# Altium schematic sheet VALVEBOARD_ValveDrive3.SchDoc
size A3; SheetNumber: 6; SheetTotal: 7
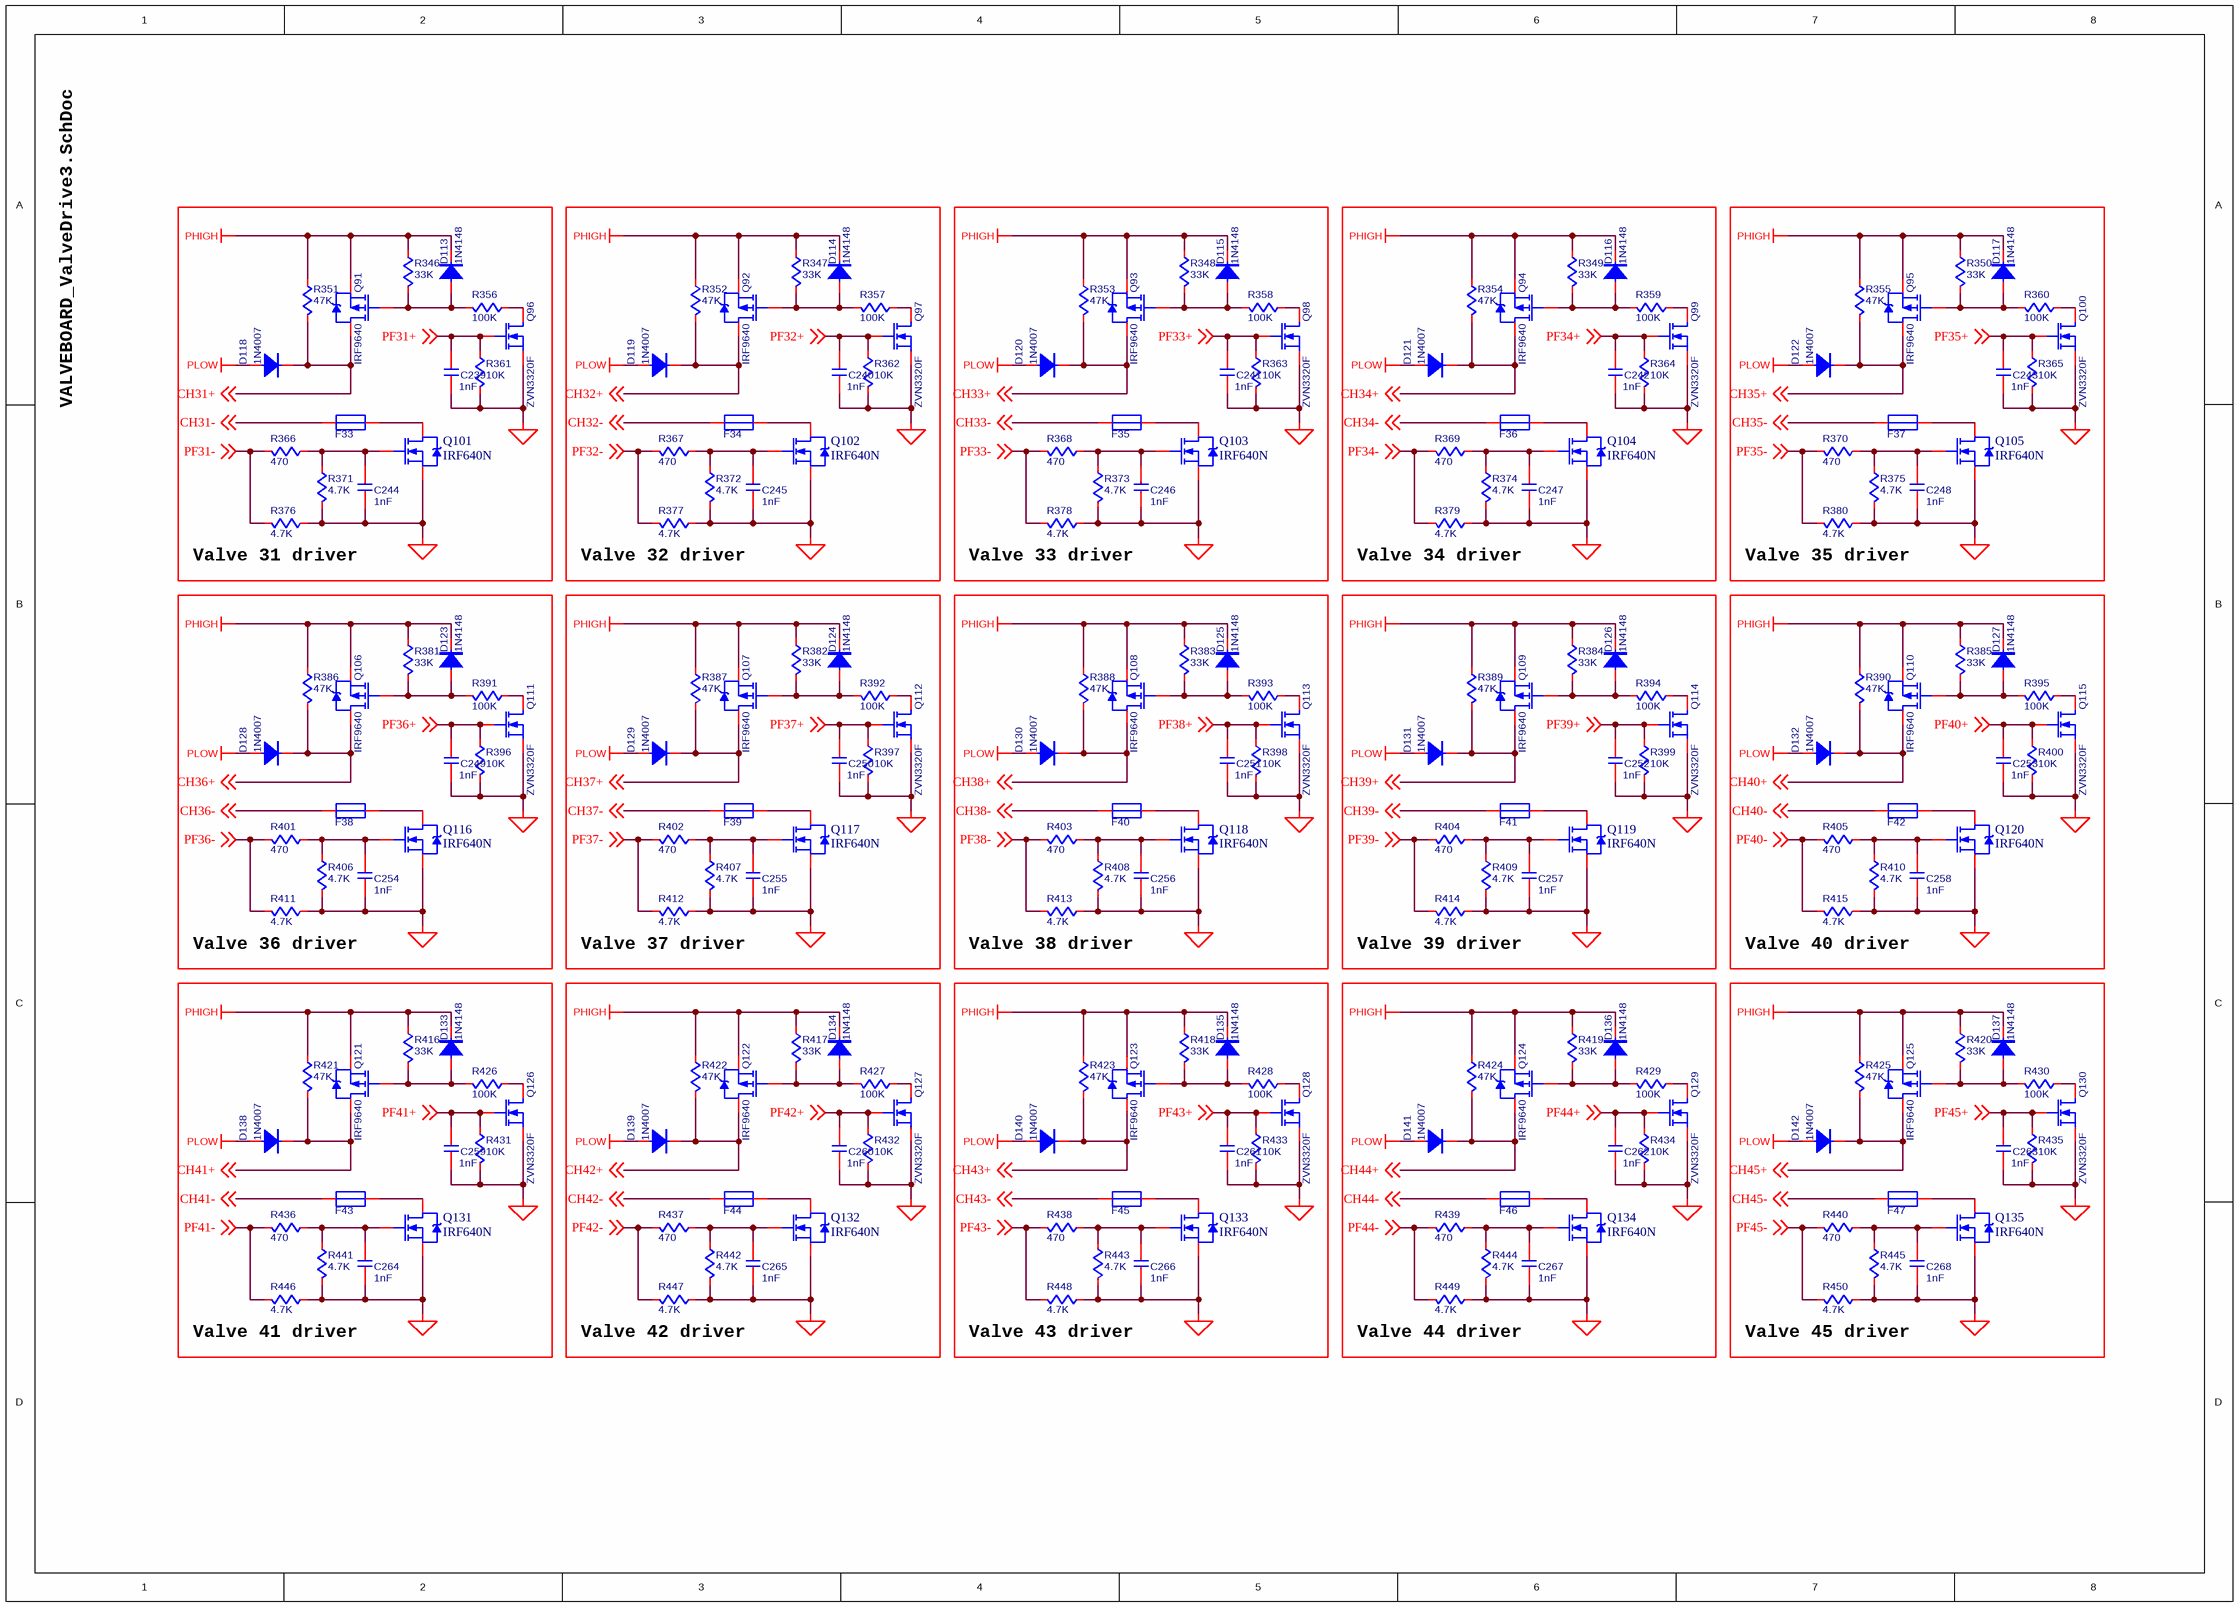
[diagram p0: VALVEBOARD_ValveDrive3.SchDoc]

## Parts
C239  value 1nF  [C0603]  (hidden comment: C-NOMO)
C240  value 1nF  [C0603]  (hidden comment: C-NOMO)
C241  value 1nF  [C0603]  (hidden comment: C-NOMO)
C242  value 1nF  [C0603]  (hidden comment: C-NOMO)
C243  value 1nF  [C0603]  (hidden comment: C-NOMO)
C244  value 1nF  [C0603]  (hidden comment: C-NOMO)
C245  value 1nF  [C0603]  (hidden comment: C-NOMO)
C246  value 1nF  [C0603]  (hidden comment: C-NOMO)
C247  value 1nF  [C0603]  (hidden comment: C-NOMO)
C248  value 1nF  [C0603]  (hidden comment: C-NOMO)
C249  value 1nF  [C0603]  (hidden comment: C-NOMO)
C250  value 1nF  [C0603]  (hidden comment: C-NOMO)
C251  value 1nF  [C0603]  (hidden comment: C-NOMO)
C252  value 1nF  [C0603]  (hidden comment: C-NOMO)
C253  value 1nF  [C0603]  (hidden comment: C-NOMO)
C254  value 1nF  [C0603]  (hidden comment: C-NOMO)
C255  value 1nF  [C0603]  (hidden comment: C-NOMO)
C256  value 1nF  [C0603]  (hidden comment: C-NOMO)
C257  value 1nF  [C0603]  (hidden comment: C-NOMO)
C258  value 1nF  [C0603]  (hidden comment: C-NOMO)
C259  value 1nF  [C0603]  (hidden comment: C-NOMO)
C260  value 1nF  [C0603]  (hidden comment: C-NOMO)
C261  value 1nF  [C0603]  (hidden comment: C-NOMO)
C262  value 1nF  [C0603]  (hidden comment: C-NOMO)
C263  value 1nF  [C0603]  (hidden comment: C-NOMO)
C264  value 1nF  [C0603]  (hidden comment: C-NOMO)
C265  value 1nF  [C0603]  (hidden comment: C-NOMO)
C266  value 1nF  [C0603]  (hidden comment: C-NOMO)
C267  value 1nF  [C0603]  (hidden comment: C-NOMO)
C268  value 1nF  [C0603]  (hidden comment: C-NOMO)
D113  1N4148  [SOD-123]
D114  1N4148  [SOD-123]
D115  1N4148  [SOD-123]
D116  1N4148  [SOD-123]
D117  1N4148  [SOD-123]
D118  1N4007  [1N4148]
D119  1N4007  [1N4148]
D120  1N4007  [1N4148]
D121  1N4007  [1N4148]
D122  1N4007  [1N4148]
D123  1N4148  [SOD-123]
D124  1N4148  [SOD-123]
D125  1N4148  [SOD-123]
D126  1N4148  [SOD-123]
D127  1N4148  [SOD-123]
D128  1N4007  [1N4148]
D129  1N4007  [1N4148]
D130  1N4007  [1N4148]
D131  1N4007  [1N4148]
D132  1N4007  [1N4148]
D133  1N4148  [SOD-123]
D134  1N4148  [SOD-123]
D135  1N4148  [SOD-123]
D136  1N4148  [SOD-123]
D137  1N4148  [SOD-123]
D138  1N4007  [1N4148]
D139  1N4007  [1N4148]
D140  1N4007  [1N4148]
D141  1N4007  [1N4148]
D142  1N4007  [1N4148]
F33  F50  [F-TH]  (value not drawn)
F34  F50  [F-TH]  (value not drawn)
F35  F50  [F-TH]  (value not drawn)
F36  F50  [F-TH]  (value not drawn)
F37  F50  [F-TH]  (value not drawn)
F38  F50  [F-TH]  (value not drawn)
F39  F50  [F-TH]  (value not drawn)
F40  F50  [F-TH]  (value not drawn)
F41  F50  [F-TH]  (value not drawn)
F42  F50  [F-TH]  (value not drawn)
F43  F50  [F-TH]  (value not drawn)
F44  F50  [F-TH]  (value not drawn)
F45  F50  [F-TH]  (value not drawn)
F46  F50  [F-TH]  (value not drawn)
F47  F50  [F-TH]  (value not drawn)
Q91  IRF9640  [TO-220AB]
Q92  IRF9640  [TO-220AB]
Q93  IRF9640  [TO-220AB]
Q94  IRF9640  [TO-220AB]
Q95  IRF9640  [TO-220AB]
Q96  ZVN3320F  [ZVN3320F]
Q97  ZVN3320F  [ZVN3320F]
Q98  ZVN3320F  [ZVN3320F]
Q99  ZVN3320F  [ZVN3320F]
Q100  ZVN3320F  [ZVN3320F]
Q101  IRF640N  [TO-220AB]
Q102  IRF640N  [TO-220AB]
Q103  IRF640N  [TO-220AB]
Q104  IRF640N  [TO-220AB]
Q105  IRF640N  [TO-220AB]
Q106  IRF9640  [TO-220AB]
Q107  IRF9640  [TO-220AB]
Q108  IRF9640  [TO-220AB]
Q109  IRF9640  [TO-220AB]
Q110  IRF9640  [TO-220AB]
Q111  ZVN3320F  [ZVN3320F]
Q112  ZVN3320F  [ZVN3320F]
Q113  ZVN3320F  [ZVN3320F]
Q114  ZVN3320F  [ZVN3320F]
Q115  ZVN3320F  [ZVN3320F]
Q116  IRF640N  [TO-220AB]
Q117  IRF640N  [TO-220AB]
Q118  IRF640N  [TO-220AB]
Q119  IRF640N  [TO-220AB]
Q120  IRF640N  [TO-220AB]
Q121  IRF9640  [TO-220AB]
Q122  IRF9640  [TO-220AB]
Q123  IRF9640  [TO-220AB]
Q124  IRF9640  [TO-220AB]
Q125  IRF9640  [TO-220AB]
Q126  ZVN3320F  [ZVN3320F]
Q127  ZVN3320F  [ZVN3320F]
Q128  ZVN3320F  [ZVN3320F]
Q129  ZVN3320F  [ZVN3320F]
Q130  ZVN3320F  [ZVN3320F]
Q131  IRF640N  [TO-220AB]
Q132  IRF640N  [TO-220AB]
Q133  IRF640N  [TO-220AB]
Q134  IRF640N  [TO-220AB]
Q135  IRF640N  [TO-220AB]
R346  value 33K  [R0603]  (hidden comment: R)
R347  value 33K  [R0603]  (hidden comment: R)
R348  value 33K  [R0603]  (hidden comment: R)
R349  value 33K  [R0603]  (hidden comment: R)
R350  value 33K  [R0603]  (hidden comment: R)
R351  value 47K  [R2512]  (hidden comment: R)
R352  value 47K  [R2512]  (hidden comment: R)
R353  value 47K  [R2512]  (hidden comment: R)
R354  value 47K  [R2512]  (hidden comment: R)
R355  value 47K  [R2512]  (hidden comment: R)
R356  value 100K  [R0603]  (hidden comment: R)
R357  value 100K  [R0603]  (hidden comment: R)
R358  value 100K  [R0603]  (hidden comment: R)
R359  value 100K  [R0603]  (hidden comment: R)
R360  value 100K  [R0603]  (hidden comment: R)
R361  value 10K  [R0603]  (hidden comment: R)
R362  value 10K  [R0603]  (hidden comment: R)
R363  value 10K  [R0603]  (hidden comment: R)
R364  value 10K  [R0603]  (hidden comment: R)
R365  value 10K  [R0603]  (hidden comment: R)
R366  value 470  [R0402]  (hidden comment: R)
R367  value 470  [R0402]  (hidden comment: R)
R368  value 470  [R0402]  (hidden comment: R)
R369  value 470  [R0402]  (hidden comment: R)
R370  value 470  [R0402]  (hidden comment: R)
R371  value 4.7K  [R0402]  (hidden comment: R)
R372  value 4.7K  [R0402]  (hidden comment: R)
R373  value 4.7K  [R0402]  (hidden comment: R)
R374  value 4.7K  [R0402]  (hidden comment: R)
R375  value 4.7K  [R0402]  (hidden comment: R)
R376  value 4.7K  [R0402]  (hidden comment: R)
R377  value 4.7K  [R0402]  (hidden comment: R)
R378  value 4.7K  [R0402]  (hidden comment: R)
R379  value 4.7K  [R0402]  (hidden comment: R)
R380  value 4.7K  [R0402]  (hidden comment: R)
R381  value 33K  [R0603]  (hidden comment: R)
R382  value 33K  [R0603]  (hidden comment: R)
R383  value 33K  [R0603]  (hidden comment: R)
R384  value 33K  [R0603]  (hidden comment: R)
R385  value 33K  [R0603]  (hidden comment: R)
R386  value 47K  [R2512]  (hidden comment: R)
R387  value 47K  [R2512]  (hidden comment: R)
R388  value 47K  [R2512]  (hidden comment: R)
R389  value 47K  [R2512]  (hidden comment: R)
R390  value 47K  [R2512]  (hidden comment: R)
R391  value 100K  [R0603]  (hidden comment: R)
R392  value 100K  [R0603]  (hidden comment: R)
R393  value 100K  [R0603]  (hidden comment: R)
R394  value 100K  [R0603]  (hidden comment: R)
R395  value 100K  [R0603]  (hidden comment: R)
R396  value 10K  [R0603]  (hidden comment: R)
R397  value 10K  [R0603]  (hidden comment: R)
R398  value 10K  [R0603]  (hidden comment: R)
R399  value 10K  [R0603]  (hidden comment: R)
R400  value 10K  [R0603]  (hidden comment: R)
R401  value 470  [R0402]  (hidden comment: R)
R402  value 470  [R0402]  (hidden comment: R)
R403  value 470  [R0402]  (hidden comment: R)
R404  value 470  [R0402]  (hidden comment: R)
R405  value 470  [R0402]  (hidden comment: R)
R406  value 4.7K  [R0402]  (hidden comment: R)
R407  value 4.7K  [R0402]  (hidden comment: R)
R408  value 4.7K  [R0402]  (hidden comment: R)
R409  value 4.7K  [R0402]  (hidden comment: R)
R410  value 4.7K  [R0402]  (hidden comment: R)
R411  value 4.7K  [R0402]  (hidden comment: R)
R412  value 4.7K  [R0402]  (hidden comment: R)
R413  value 4.7K  [R0402]  (hidden comment: R)
R414  value 4.7K  [R0402]  (hidden comment: R)
R415  value 4.7K  [R0402]  (hidden comment: R)
R416  value 33K  [R0603]  (hidden comment: R)
R417  value 33K  [R0603]  (hidden comment: R)
R418  value 33K  [R0603]  (hidden comment: R)
R419  value 33K  [R0603]  (hidden comment: R)
R420  value 33K  [R0603]  (hidden comment: R)
R421  value 47K  [R2512]  (hidden comment: R)
R422  value 47K  [R2512]  (hidden comment: R)
R423  value 47K  [R2512]  (hidden comment: R)
R424  value 47K  [R2512]  (hidden comment: R)
R425  value 47K  [R2512]  (hidden comment: R)
R426  value 100K  [R0603]  (hidden comment: R)
R427  value 100K  [R0603]  (hidden comment: R)
R428  value 100K  [R0603]  (hidden comment: R)
R429  value 100K  [R0603]  (hidden comment: R)
R430  value 100K  [R0603]  (hidden comment: R)
R431  value 10K  [R0603]  (hidden comment: R)
R432  value 10K  [R0603]  (hidden comment: R)
R433  value 10K  [R0603]  (hidden comment: R)
R434  value 10K  [R0603]  (hidden comment: R)
R435  value 10K  [R0603]  (hidden comment: R)
R436  value 470  [R0402]  (hidden comment: R)
R437  value 470  [R0402]  (hidden comment: R)
R438  value 470  [R0402]  (hidden comment: R)
R439  value 470  [R0402]  (hidden comment: R)
R440  value 470  [R0402]  (hidden comment: R)
R441  value 4.7K  [R0402]  (hidden comment: R)
R442  value 4.7K  [R0402]  (hidden comment: R)
R443  value 4.7K  [R0402]  (hidden comment: R)
R444  value 4.7K  [R0402]  (hidden comment: R)
R445  value 4.7K  [R0402]  (hidden comment: R)
R446  value 4.7K  [R0402]  (hidden comment: R)
R447  value 4.7K  [R0402]  (hidden comment: R)
R448  value 4.7K  [R0402]  (hidden comment: R)
R449  value 4.7K  [R0402]  (hidden comment: R)
R450  value 4.7K  [R0402]  (hidden comment: R)

## Blocks framed on the sheet
Valve 31 driver: C239 C244 D113 D118 F33 Q91 Q96 Q101 R346 R351 R356 R361 R366 R371 R376
Valve 32 driver: C240 C245 D114 D119 F34 Q92 Q97 Q102 R347 R352 R357 R362 R367 R372 R377
Valve 33 driver: C241 C246 D115 D120 F35 Q93 Q98 Q103 R348 R353 R358 R363 R368 R373 R378
Valve 34 driver: C242 C247 D116 D121 F36 Q94 Q99 Q104 R349 R354 R359 R364 R369 R374 R379
Valve 35 driver: C243 C248 D117 D122 F37 Q95 Q100 Q105 R350 R355 R360 R365 R370 R375 R380
Valve 36 driver: C249 C254 D123 D128 F38 Q106 Q111 Q116 R381 R386 R391 R396 R401 R406 R411
Valve 37 driver: C250 C255 D124 D129 F39 Q107 Q112 Q117 R382 R387 R392 R397 R402 R407 R412
Valve 38 driver: C251 C256 D125 D130 F40 Q108 Q113 Q118 R383 R388 R393 R398 R403 R408 R413
Valve 39 driver: C252 C257 D126 D131 F41 Q109 Q114 Q119 R384 R389 R394 R399 R404 R409 R414
Valve 40 driver: C253 C258 D127 D132 F42 Q110 Q115 Q120 R385 R390 R395 R400 R405 R410 R415
Valve 41 driver: C259 C264 D133 D138 F43 Q121 Q126 Q131 R416 R421 R426 R431 R436 R441 R446
Valve 42 driver: C260 C265 D134 D139 F44 Q122 Q127 Q132 R417 R422 R427 R432 R437 R442 R447
Valve 43 driver: C261 C266 D135 D140 F45 Q123 Q128 Q133 R418 R423 R428 R433 R438 R443 R448
Valve 44 driver: C262 C267 D136 D141 F46 Q124 Q129 Q134 R419 R424 R429 R434 R439 R444 R449
Valve 45 driver: C263 C268 D137 D142 F47 Q125 Q130 Q135 R420 R425 R430 R435 R440 R445 R450

## Nets
PGND: C239.1 C240.1 C241.1 C242.1 C243.1 C244.1 C245.1 C246.1 C247.1 C248.1 C249.1 C250.1 C251.1 C252.1 C253.1 C254.1 C255.1 C256.1 C257.1 C258.1 C259.1 C260.1 C261.1 C262.1 C263.1 C264.1 C265.1 C266.1 C267.1 C268.1 Q96.3(S) Q97.3(S) Q98.3(S) Q99.3(S) Q100.3(S) Q101.3(S) Q102.3(S) Q103.3(S) Q104.3(S) Q105.3(S) Q111.3(S) Q112.3(S) Q113.3(S) Q114.3(S) Q115.3(S) Q116.3(S) Q117.3(S) Q118.3(S) Q119.3(S) Q120.3(S) Q126.3(S) Q127.3(S) Q128.3(S) Q129.3(S) Q130.3(S) Q131.3(S) Q132.3(S) Q133.3(S) Q134.3(S) Q135.3(S) R361.1 R362.1 R363.1 R364.1 R365.1 R371.1 R372.1 R373.1 R374.1 R375.1 R376.2 R377.2 R378.2 R379.2 R380.2 R396.1 R397.1 R398.1 R399.1 R400.1 R406.1 R407.1 R408.1 R409.1 R410.1 R411.2 R412.2 R413.2 R414.2 R415.2 R431.1 R432.1 R433.1 R434.1 R435.1 R441.1 R442.1 R443.1 R444.1 R445.1 R446.2 R447.2 R448.2 R449.2 R450.2
PHIGH: D113.1 D114.1 D115.1 D116.1 D117.1 D123.1 D124.1 D125.1 D126.1 D127.1 D133.1 D134.1 D135.1 D136.1 D137.1 Q91.3(S) Q92.3(S) Q93.3(S) Q94.3(S) Q95.3(S) Q106.3(S) Q107.3(S) Q108.3(S) Q109.3(S) Q110.3(S) Q121.3(S) Q122.3(S) Q123.3(S) Q124.3(S) Q125.3(S) R346.2 R347.2 R348.2 R349.2 R350.2 R351.2 R352.2 R353.2 R354.2 R355.2 R381.2 R382.2 R383.2 R384.2 R385.2 R386.2 R387.2 R388.2 R389.2 R390.2 R416.2 R417.2 R418.2 R419.2 R420.2 R421.2 R422.2 R423.2 R424.2 R425.2
PLOW: D118.2 D119.2 D120.2 D121.2 D122.2 D128.2 D129.2 D130.2 D131.2 D132.2 D138.2 D139.2 D140.2 D141.2 D142.2
CH31+: D118.1 Q91.2(D) R351.1 ; off-sheet CH31+
CH31-: F33.1 ; off-sheet CH31-
CH32+: D119.1 Q92.2(D) R352.1 ; off-sheet CH32+
CH32-: F34.1 ; off-sheet CH32-
CH33+: D120.1 Q93.2(D) R353.1 ; off-sheet CH33+
CH33-: F35.1 ; off-sheet CH33-
CH34+: D121.1 Q94.2(D) R354.1 ; off-sheet CH34+
CH34-: F36.1 ; off-sheet CH34-
CH35+: D122.1 Q95.2(D) R355.1 ; off-sheet CH35+
CH35-: F37.1 ; off-sheet CH35-
CH36+: D128.1 Q106.2(D) R386.1 ; off-sheet CH36+
CH36-: F38.1 ; off-sheet CH36-
CH37+: D129.1 Q107.2(D) R387.1 ; off-sheet CH37+
CH37-: F39.1 ; off-sheet CH37-
CH38+: D130.1 Q108.2(D) R388.1 ; off-sheet CH38+
CH38-: F40.1 ; off-sheet CH38-
CH39+: D131.1 Q109.2(D) R389.1 ; off-sheet CH39+
CH39-: F41.1 ; off-sheet CH39-
CH40+: D132.1 Q110.2(D) R390.1 ; off-sheet CH40+
CH40-: F42.1 ; off-sheet CH40-
CH41+: D138.1 Q121.2(D) R421.1 ; off-sheet CH41+
CH41-: F43.1 ; off-sheet CH41-
CH42+: D139.1 Q122.2(D) R422.1 ; off-sheet CH42+
CH42-: F44.1 ; off-sheet CH42-
CH43+: D140.1 Q123.2(D) R423.1 ; off-sheet CH43+
CH43-: F45.1 ; off-sheet CH43-
CH44+: D141.1 Q124.2(D) R424.1 ; off-sheet CH44+
CH44-: F46.1 ; off-sheet CH44-
CH45+: D142.1 Q125.2(D) R425.1 ; off-sheet CH45+
CH45-: F47.1 ; off-sheet CH45-
PF31+: C239.2 Q96.2(G) R361.2 ; off-sheet PF31+
PF31-: R366.1 R376.1 ; off-sheet PF31-
PF32+: C240.2 Q97.2(G) R362.2 ; off-sheet PF32+
PF32-: R367.1 R377.1 ; off-sheet PF32-
PF33+: C241.2 Q98.2(G) R363.2 ; off-sheet PF33+
PF33-: R368.1 R378.1 ; off-sheet PF33-
PF34+: C242.2 Q99.2(G) R364.2 ; off-sheet PF34+
PF34-: R369.1 R379.1 ; off-sheet PF34-
PF35+: C243.2 Q100.2(G) R365.2 ; off-sheet PF35+
PF35-: R370.1 R380.1 ; off-sheet PF35-
PF36+: C249.2 Q111.2(G) R396.2 ; off-sheet PF36+
PF36-: R401.1 R411.1 ; off-sheet PF36-
PF37+: C250.2 Q112.2(G) R397.2 ; off-sheet PF37+
PF37-: R402.1 R412.1 ; off-sheet PF37-
PF38+: C251.2 Q113.2(G) R398.2 ; off-sheet PF38+
PF38-: R403.1 R413.1 ; off-sheet PF38-
PF39+: C252.2 Q114.2(G) R399.2 ; off-sheet PF39+
PF39-: R404.1 R414.1 ; off-sheet PF39-
PF40+: C253.2 Q115.2(G) R400.2 ; off-sheet PF40+
PF40-: R405.1 R415.1 ; off-sheet PF40-
PF41+: C259.2 Q126.2(G) R431.2 ; off-sheet PF41+
PF41-: R436.1 R446.1 ; off-sheet PF41-
PF42+: C260.2 Q127.2(G) R432.2 ; off-sheet PF42+
PF42-: R437.1 R447.1 ; off-sheet PF42-
PF43+: C261.2 Q128.2(G) R433.2 ; off-sheet PF43+
PF43-: R438.1 R448.1 ; off-sheet PF43-
PF44+: C262.2 Q129.2(G) R434.2 ; off-sheet PF44+
PF44-: R439.1 R449.1 ; off-sheet PF44-
PF45+: C263.2 Q130.2(G) R435.2 ; off-sheet PF45+
PF45-: R440.1 R450.1 ; off-sheet PF45-
NetC244_2: C244.2 Q101.1(G) R366.2 R371.2
NetC245_2: C245.2 Q102.1(G) R367.2 R372.2
NetC246_2: C246.2 Q103.1(G) R368.2 R373.2
NetC247_2: C247.2 Q104.1(G) R369.2 R374.2
NetC248_2: C248.2 Q105.1(G) R370.2 R375.2
NetC254_2: C254.2 Q116.1(G) R401.2 R406.2
NetC255_2: C255.2 Q117.1(G) R402.2 R407.2
NetC256_2: C256.2 Q118.1(G) R403.2 R408.2
NetC257_2: C257.2 Q119.1(G) R404.2 R409.2
NetC258_2: C258.2 Q120.1(G) R405.2 R410.2
NetC264_2: C264.2 Q131.1(G) R436.2 R441.2
NetC265_2: C265.2 Q132.1(G) R437.2 R442.2
NetC266_2: C266.2 Q133.1(G) R438.2 R443.2
NetC267_2: C267.2 Q134.1(G) R439.2 R444.2
NetC268_2: C268.2 Q135.1(G) R440.2 R445.2
NetD113_2: D113.2 Q91.1(G) R346.1 R356.1
NetD114_2: D114.2 Q92.1(G) R347.1 R357.1
NetD115_2: D115.2 Q93.1(G) R348.1 R358.1
NetD116_2: D116.2 Q94.1(G) R349.1 R359.1
NetD117_2: D117.2 Q95.1(G) R350.1 R360.1
NetD123_2: D123.2 Q106.1(G) R381.1 R391.1
NetD124_2: D124.2 Q107.1(G) R382.1 R392.1
NetD125_2: D125.2 Q108.1(G) R383.1 R393.1
NetD126_2: D126.2 Q109.1(G) R384.1 R394.1
NetD127_2: D127.2 Q110.1(G) R385.1 R395.1
NetD133_2: D133.2 Q121.1(G) R416.1 R426.1
NetD134_2: D134.2 Q122.1(G) R417.1 R427.1
NetD135_2: D135.2 Q123.1(G) R418.1 R428.1
NetD136_2: D136.2 Q124.1(G) R419.1 R429.1
NetD137_2: D137.2 Q125.1(G) R420.1 R430.1
NetF33_2: F33.2 Q101.2(D)
NetF34_2: F34.2 Q102.2(D)
NetF35_2: F35.2 Q103.2(D)
NetF36_2: F36.2 Q104.2(D)
NetF37_2: F37.2 Q105.2(D)
NetF38_2: F38.2 Q116.2(D)
NetF39_2: F39.2 Q117.2(D)
NetF40_2: F40.2 Q118.2(D)
NetF41_2: F41.2 Q119.2(D)
NetF42_2: F42.2 Q120.2(D)
NetF43_2: F43.2 Q131.2(D)
NetF44_2: F44.2 Q132.2(D)
NetF45_2: F45.2 Q133.2(D)
NetF46_2: F46.2 Q134.2(D)
NetF47_2: F47.2 Q135.2(D)
NetQ96_1: Q96.1(D) R356.2
NetQ97_1: Q97.1(D) R357.2
NetQ98_1: Q98.1(D) R358.2
NetQ99_1: Q99.1(D) R359.2
NetQ100_1: Q100.1(D) R360.2
NetQ111_1: Q111.1(D) R391.2
NetQ112_1: Q112.1(D) R392.2
NetQ113_1: Q113.1(D) R393.2
NetQ114_1: Q114.1(D) R394.2
NetQ115_1: Q115.1(D) R395.2
NetQ126_1: Q126.1(D) R426.2
NetQ127_1: Q127.1(D) R427.2
NetQ128_1: Q128.1(D) R428.2
NetQ129_1: Q129.1(D) R429.2
NetQ130_1: Q130.1(D) R430.2

## Library data of the parts
C239-C268 = C-NOMO: voltage: 25V; precision: 5%
D113-D142 = DIOD1
Q91-Q95 Q106-Q110 Q121-Q125 = IRF9640: P-Channel Power MOSFET; Note: Pin 4 not drawn and electrically connected to Pin 2.; Published: 8-Jun-2000; LatestRevisionDate: 17-Jul-2002; LatestRevisionNote: Re-released for DXP Platform.; DatasheetVersion: PD-9.390D; PackageVersion: Feb-1997; PackageReference: TO-220AB; Publisher: Altium Limited; PackageDescription: TO, Thru-Hole, Vertical, Heatsink Mounted; 3 In-Line Leads; Pitch 2.54 mm; ComponentLink1Description: Manufacturer Link; ComponentLink1URL: http://www.irf.com/
Q96-Q100 Q111-Q115 Q126-Q130 = ZVN3320F: N-Channel MOSFET; Published: 8-Jun-2000; LatestRevisionDate: 17-Jul-2002; LatestRevisionNote: Re-released for DXP Platform.; PackageVersion: 1995/1996; PackageReference: E3; Publisher: Altium Limited; PackageDescription: TO, Flat Index; 3 In-Line, Axial Leads; Body Dia. 4.6mm; Lead Dia. 0.5 mm (max)
Q101-Q105 Q116-Q120 Q131-Q135 = IRF640N: N-Channel Power MOSFET; Note: Pin 2 is electrically connected to pin 4.; Published: 8-Jun-2000; LatestRevisionDate: 17-Jul-2002; LatestRevisionNote: Re-released for DXP Platform.; DatasheetVersion: PD-9.814; PackageVersion: Feb-1997; PackageReference: TO-220AB; Publisher: Altium Limited; PackageDescription: TO, Thru-Hole, Vertical, Heatsink Mounted; 3 In-Line Leads; Pitch 2.54 mm; ComponentLink1Description: Manufacturer Link; ComponentLink1URL: http://www.irf.com/
R346-R450 = R: precision: 1%